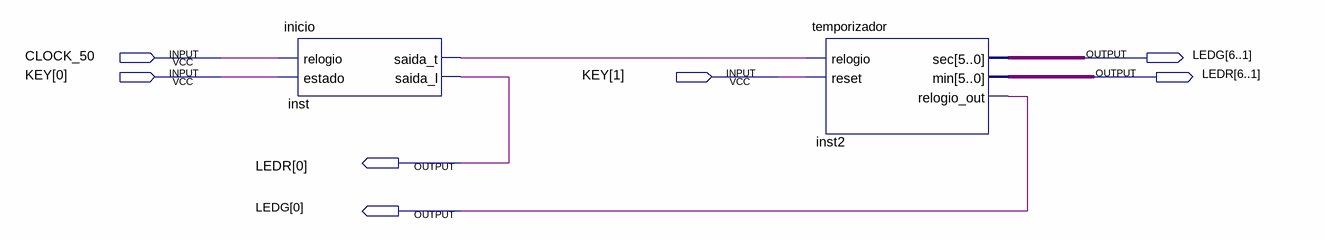
[diagram p0: schematic sheet]
// Quartus schematic esquema.bdf as structural Verilog: 2 symbols, 7 pins
module esquema (
  input  CLOCK_50,
  input  [1:0] KEY,
  output [6:0] LEDG,
  output [6:0] LEDR
);

  wire inst_saida_t;

  inicio inst (.relogio(CLOCK_50), .estado(KEY[0]), .saida_t(inst_saida_t), .saida_l(LEDR[0]));
  temporizador inst2 (.relogio(inst_saida_t), .reset(KEY[1]), .sec(LEDG[6:1]), .min(LEDR[6:1]), .relogio_out(LEDG[0]));
endmodule
